# EAGLE schematic TurboMaster-optimized (EAGLE 7.7.0)
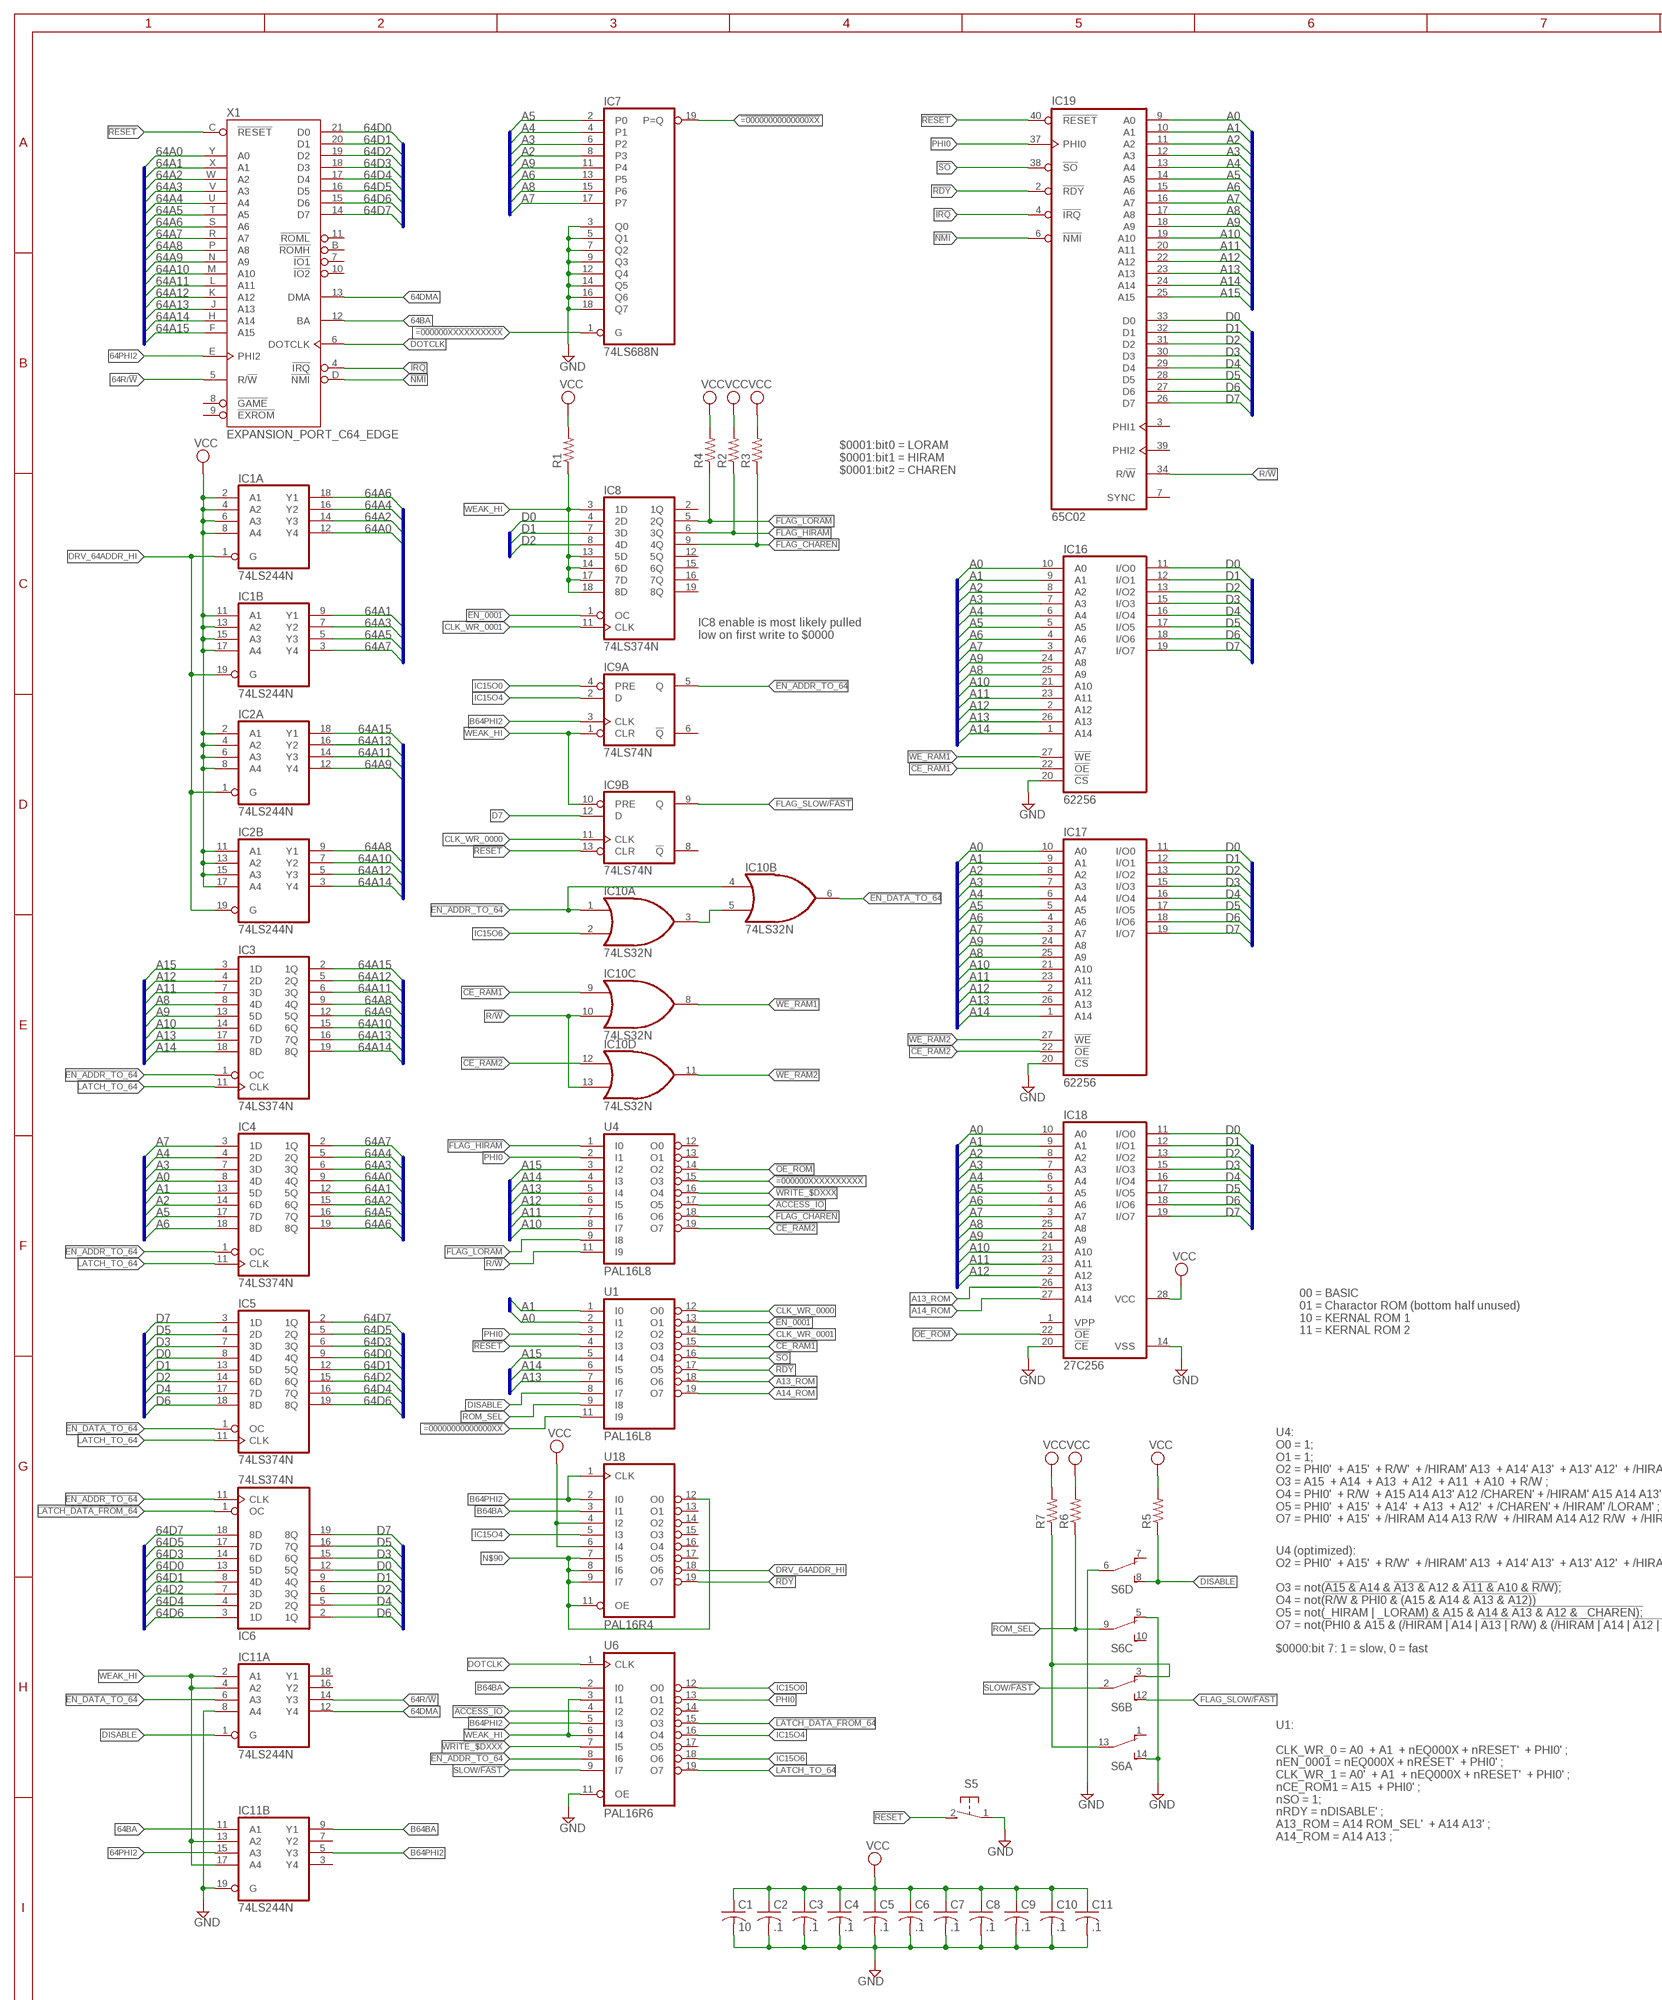
[diagram p0: schematic, sheet 1, part 1 of 2]
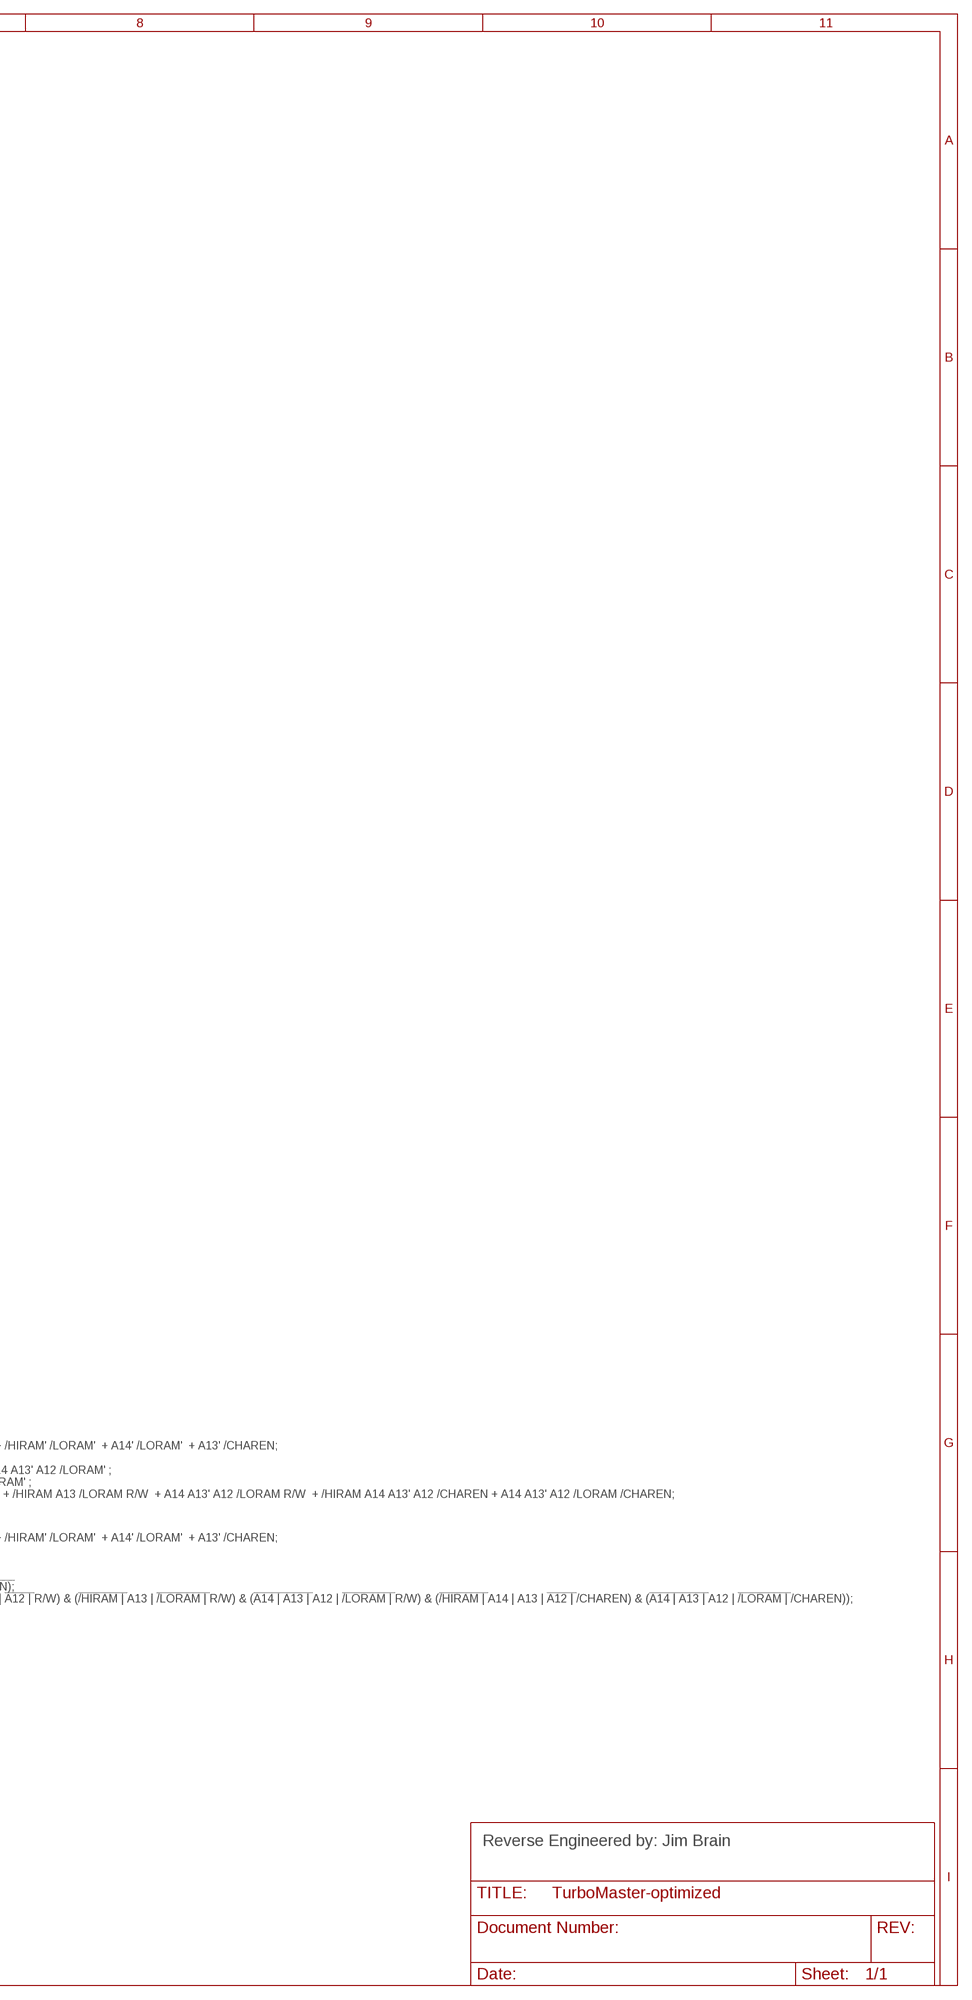
[diagram p1: schematic, sheet 1, part 2 of 2]

## Parts
C1  10  C-US050-024X044  [C050-024X044]
C2  .1  C-US050-024X044  [C050-024X044]
C3  .1  C-US050-024X044  [C050-024X044]
C4  .1  C-US050-024X044  [C050-024X044]
C5  .1  C-US050-024X044  [C050-024X044]
C6  .1  C-US050-024X044  [C050-024X044]
C7  .1  C-US050-024X044  [C050-024X044]
C8  .1  C-US050-024X044  [C050-024X044]
C9  .1  C-US050-024X044  [C050-024X044]
C10  .1  C-US050-024X044  [C050-024X044]
C11  .1  C-US050-024X044  [C050-024X044]
IC1  74LS244N  [DIL20]
IC2  74LS244N  [DIL20]
IC3  74LS374N  [DIL20]
IC4  74LS374N  [DIL20]
IC5  74LS374N  [DIL20]
IC6  74LS374N  [DIL20]
IC7  74LS688N  [DIL20]
IC8  74LS374N  [DIL20]
IC9  74LS74N  [DIL14]
IC10  74LS32N  [DIL14]
IC11  74LS244N  [DIL20]
IC16  62256  [DIL28]
IC17  62256  [DIL28]
IC18  27C256  27C256AG  [DIL28-6]
IC19  65C02  [DIL40]
R1  R-US_0207/10  [0207/10]
R2  R-US_0207/10  [0207/10]
R3  R-US_0207/10  [0207/10]
R4  R-US_0207/10  [0207/10]
R5  R-US_0207/10  [0207/10]
R6  R-US_0207/10  [0207/10]
R7  R-US_0207/10  [0207/10]
S5  31-XX  [B3F-31XX]
S6  DIP04DPDTS  [DIP04DPDTS]
U1  PAL16L8  16L8  [DIL20]
U4  PAL16L8  16L8  [DIL20]
U6  PAL16R6  16R6  [DIL20]
U18  PAL16R4  16R4  [DIL20]
X1  EXPANSION_PORT_C64_EDGE  [MA100-22-2]

## Nets
64A0: IC1.12(A:Y4) IC4.9(4Q) X1.Y(A0)
64A1: IC1.9(B:Y1) IC4.12(5Q) X1.X(A1)
64A2: IC1.14(A:Y3) IC4.15(6Q) X1.W(A2)
64A3: IC1.7(B:Y2) IC4.6(3Q) X1.V(A3)
64A4: IC1.16(A:Y2) IC4.5(2Q) X1.U(A4)
64A5: IC1.5(B:Y3) IC4.16(7Q) X1.T(A5)
64A6: IC1.18(A:Y1) IC4.19(8Q) X1.S(A6)
64A7: IC1.3(B:Y4) IC4.2(1Q) X1.R(A7)
64A8: IC2.9(B:Y1) IC3.9(4Q) X1.P(A8)
64A9: IC2.12(A:Y4) IC3.12(5Q) X1.N(A9)
64A10: IC2.7(B:Y2) IC3.15(6Q) X1.M(A10)
64A11: IC2.14(A:Y3) IC3.6(3Q) X1.L(A11)
64A12: IC2.5(B:Y3) IC3.5(2Q) X1.K(A12)
64A13: IC2.16(A:Y2) IC3.16(7Q) X1.J(A13)
64A14: IC2.3(B:Y4) IC3.19(8Q) X1.H(A14)
64A15: IC2.18(A:Y1) IC3.2(1Q) X1.F(A15)
64BA: IC11.11(B:A1) X1.12(BA)
64D0: IC5.9(4Q) IC6.13(5D) X1.21(D0)
64D1: IC5.12(5Q) IC6.8(4D) X1.20(D1)
64D2: IC5.15(6Q) IC6.7(3D) X1.19(D2)
64D3: IC5.6(3Q) IC6.14(6D) X1.18(D3)
64D4: IC5.16(7Q) IC6.4(2D) X1.17(D4)
64D5: IC5.5(2Q) IC6.17(7D) X1.16(D5)
64D6: IC5.19(8Q) IC6.3(1D) X1.15(D6)
64D7: IC5.2(1Q) IC6.18(8D) X1.14(D7)
64DMA: IC11.12(A:Y4) X1.13(DMA)
64PHI2: IC11.15(B:A3) X1.E(PHI2)
64R/!W: IC11.14(A:Y3) X1.5(R/!W)
!=00000000000000XX: IC7.19(P=Q) U1.11(I9)
!=000000XXXXXXXXXX: IC7.1(G) U4.15(O3)
!ACCESS_IO: U4.17(O5) U6.4(I2)
!CE_RAM1: IC10.9(C:I0) IC16.22(!OE) U1.15(O3)
!CE_RAM2: IC10.12(D:I0) IC17.22(!OE) U4.19(O7)
!EN_0001: IC8.1(OC) U1.13(O1)
!EN_ADDR_TO_64: IC3.1(OC) IC4.1(OC) IC6.11(CLK) IC9.5(A:Q) IC10.1(A:I0) IC10.4(B:I0) U6.8(I6)
!EN_DATA_TO_64: IC5.1(OC) IC10.6(B:O) IC11.6(A:A3)
!FLAG_CHAREN: IC8.9(4Q) R3.1 U4.18(O6)
!FLAG_HIRAM: IC8.6(3Q) R2.1 U4.1(I0)
!FLAG_LORAM: IC8.5(2Q) R4.1 U4.9(I8)
!IRQ: IC19.4(!IRQ) X1.4(!IRQ)
!LATCH_DATA_FROM_64: IC6.1(OC) U6.15(O3)
!NMI: IC19.6(!NMI) X1.D(!NMI)
!OE_ROM: IC18.22(!OE) U4.14(O2)
!RDY: IC19.2(!RDY) U1.17(O5) U18.19(O7)
!RESET: IC9.13(B:CLR) IC19.40(!RESET) S5.2(S) U1.4(I3) X1.C(!RESET)
!SO: IC19.38(!SO) U1.16(O4)
!WE_RAM1: IC10.8(C:O) IC16.27(!WE)
!WE_RAM2: IC10.11(D:O) IC17.27(!WE)
!WRITE_$DXXX: U4.16(O4) U6.7(I5)
A0: IC4.8(4D) IC16.10(A0) IC17.10(A0) IC18.10(A0) IC19.9(A0) U1.2(I1)
A1: IC4.13(5D) IC16.9(A1) IC17.9(A1) IC18.9(A1) IC19.10(A1) U1.1(I0)
A2: IC4.14(6D) IC7.8(P3) IC16.8(A2) IC17.8(A2) IC18.8(A2) IC19.11(A2)
A3: IC4.7(3D) IC7.6(P2) IC16.7(A3) IC17.7(A3) IC18.7(A3) IC19.12(A3)
A4: IC4.4(2D) IC7.4(P1) IC16.6(A4) IC17.6(A4) IC18.6(A4) IC19.13(A4)
A5: IC4.17(7D) IC7.2(P0) IC16.5(A5) IC17.5(A5) IC18.5(A5) IC19.14(A5)
A6: IC4.18(8D) IC7.13(P5) IC16.4(A6) IC17.4(A6) IC18.4(A6) IC19.15(A6)
A7: IC4.3(1D) IC7.17(P7) IC16.3(A7) IC17.3(A7) IC18.3(A7) IC19.16(A7)
A8: IC3.8(4D) IC7.15(P6) IC16.25(A9) IC17.25(A9) IC18.25(A8) IC19.17(A8)
A9: IC3.13(5D) IC7.11(P4) IC16.24(A8) IC17.24(A8) IC18.24(A9) IC19.18(A9)
A10: IC3.14(6D) IC16.21(A10) IC17.21(A10) IC18.21(A10) IC19.19(A10) U4.8(I7)
A11: IC3.7(3D) IC16.23(A11) IC17.23(A11) IC18.23(A11) IC19.20(A11) U4.7(I6)
A12: IC3.4(2D) IC16.2(A12) IC17.2(A12) IC18.2(A12) IC19.22(A12) U4.6(I5)
A13: IC3.17(7D) IC16.26(A13) IC17.26(A13) IC19.23(A13) U1.7(I6) U4.5(I4)
A13_ROM: IC18.26(A13) U1.18(O6)
A14: IC3.18(8D) IC16.1(A14) IC17.1(A14) IC19.24(A14) U1.6(I5) U4.4(I3)
A14_ROM: IC18.27(A14) U1.19(O7)
A15: IC3.3(1D) IC19.25(A15) U1.5(I4) U4.3(I2)
B64BA: IC11.9(B:Y1) U6.2(I0) U18.3(I1)
B64PHI2: IC9.3(A:CLK) IC11.5(B:Y3) U6.5(I3) U18.1(CLK) U18.2(I0)
CLK_WR_0000: IC9.11(B:CLK) U1.12(O0)
CLK_WR_0001: IC8.11(CLK) U1.14(O2)
D0: IC5.8(4D) IC6.12(5Q) IC8.4(2D) IC16.11(I/O0) IC17.11(I/O0) IC18.11(I/O0) IC19.33(D0)
D1: IC5.13(5D) IC6.9(4Q) IC8.7(3D) IC16.12(I/O1) IC17.12(I/O1) IC18.12(I/O1) IC19.32(D1)
D2: IC5.14(6D) IC6.6(3Q) IC8.8(4D) IC16.13(I/O2) IC17.13(I/O2) IC18.13(I/O2) IC19.31(D2)
D3: IC5.7(3D) IC6.15(6Q) IC16.15(I/O3) IC17.15(I/O3) IC18.15(I/O3) IC19.30(D3)
D4: IC5.17(7D) IC6.5(2Q) IC16.16(I/O4) IC17.16(I/O4) IC18.16(I/O4) IC19.29(D4)
D5: IC5.4(2D) IC6.16(7Q) IC16.17(I/O5) IC17.17(I/O5) IC18.17(I/O5) IC19.28(D5)
D6: IC5.18(8D) IC6.2(1Q) IC16.18(I/O6) IC17.18(I/O6) IC18.18(I/O6) IC19.27(D6)
D7: IC5.3(1D) IC6.19(8Q) IC9.12(B:D) IC16.19(I/O7) IC17.19(I/O7) IC18.19(I/O7) IC19.26(D7)
DISABLE: IC11.1(A:G) R5.1 S6.8(D:S) U1.8(I7)
DOTCLK: U6.1(CLK) X1.6(DOTCLK)
DRV_64ADDR_HI: IC1.1(A:G) IC1.19(B:G) IC2.1(A:G) IC2.19(B:G) U18.18(O6)
FLAG_SLOW/!FAST: IC9.9(B:Q) S6.12(B:S)
GND: C1.2 C2.2 C3.2 C4.2 C5.2 C6.2 C7.2 C8.2 C9.2 C10.2 C11.2 IC7.3(Q0) IC7.5(Q1) IC7.7(Q2) IC7.9(Q3) IC7.12(Q4) IC7.14(Q5) IC7.16(Q6) IC7.18(Q7) IC11.8(A:A4) IC11.19(B:G) IC16.20(!CS) IC17.20(!CS) IC18.14(VSS) IC18.20(!CE) S5.1(P) S6.5(C:O) S6.6(D:P) S6.14(A:S) U6.11(OE)
IC15O0: IC9.4(A:PRE) U6.12(O0)
IC15O4: IC9.2(A:D) U6.16(O4) U18.5(I3)
IC15O6: IC10.2(A:I1) U6.18(O6)
LATCH_TO_64: IC3.11(CLK) IC4.11(CLK) IC5.11(CLK) U6.19(O7)
N$52: R7.1 S6.3(B:O) S6.13(A:P)
N$65: IC10.3(A:O) IC10.5(B:I1)
N$90: U18.7(I5) U18.8(I6) U18.9(I7) U18.11(OE) U18.12(O0)
PHI0: IC19.37(PHI0) U1.3(I2) U4.2(I1) U6.13(O1)
R/!W: IC10.10(C:I1) IC10.13(D:I1) IC19.34(R/!W) U4.11(I9)
ROM_SEL: R6.1 S6.9(C:P) U1.9(I8)
SLOW/!FAST: S6.2(B:P) U6.9(I7)
VCC: C1.1 C2.1 C3.1 C4.1 C5.1 C6.1 C7.1 C8.1 C9.1 C10.1 C11.1 IC1.2(A:A1) IC1.4(A:A2) IC1.6(A:A3) IC1.8(A:A4) IC1.11(B:A1) IC1.13(B:A2) IC1.15(B:A3) IC1.17(B:A4) IC2.2(A:A1) IC2.4(A:A2) IC2.6(A:A3) IC2.8(A:A4) IC2.11(B:A1) IC2.13(B:A2) IC2.15(B:A3) IC2.17(B:A4) IC18.28(VCC) R1.2 R2.2 R3.2 R4.2 R5.2 R6.2 R7.2 U18.4(I2) U18.6(I4)
WEAK_HI: IC8.3(1D) IC8.13(5D) IC8.14(6D) IC8.17(7D) IC8.18(8D) IC9.1(A:CLR) IC9.10(B:PRE) IC11.2(A:A1) IC11.4(A:A2) IC11.13(B:A2) IC11.17(B:A4) R1.1 U6.3(I1) U6.6(I4)
Unconnected: IC8.2(1Q) IC8.12(5Q) IC8.15(6Q) IC8.16(7Q) IC8.19(8Q) IC9.6(A:!Q) IC9.8(B:!Q) IC11.3(B:Y4) IC11.7(B:Y2) IC11.16(A:Y2) IC11.18(A:Y1) IC18.1(VPP) IC19.3(PHI1) IC19.7(SYNC) IC19.39(PHI2) S6.1(A:O) S6.7(D:O) S6.10(C:S) U4.12(O0) U4.13(O1) U6.14(O2) U6.17(O5) U18.13(O1) U18.14(O2) U18.15(O3) U18.16(O4) U18.17(O5) X1.7(!IO1) X1.8(!GAME) X1.9(!EXROM) X1.10(!IO2) X1.11(!ROML) X1.B(!ROMH)

## Buses
64A[0..15]
A[0..15]
D[0..7]
64D[0..7]

## Notes on the sheet
- $0001:bit0 = LORAM
  $0001:bit1 = HIRAM
  $0001:bit2 = CHAREN
- IC8 enable is most likely pulled
  low on first write to $0000
- 00 = BASIC
  01 = Charactor ROM (bottom half unused)
  10 = KERNAL ROM 1
  11 = KERNAL ROM 2
- U4:
  O0 = 1;
  O1 = 1;
  O2 = PHI0'  + A15'  + R/W'  + /HIRAM' A13  + A14' A13'  + A13' A12'  + /HIRAM' /LORAM'  + A14' /LORAM'  + A13' /CHAREN;
  O3 = A15  + A14  + A13  + A12  + A11  + A10  + R/W ;
  O4 = PHI0'  + R/W  + A15 A14 A13' A12 /CHAREN' + /HIRAM' A15 A14 A13' A12 /LORAM' ;
  O5 = PHI0'  + A15'  + A14'  + A13  + A12'  + /CHAREN' + /HIRAM' /LORAM' ;
  O7 = PHI0'  + A15'  + /HIRAM A14 A13 R/W  + /HIRAM A14 A12 R/W  + /HIRAM A13 /LORAM R/W  + A14 A13' A12 /LORAM R/W  + /HIRAM A14 A13' A12 /CHAREN + A14 A13' A12 /LORAM /CHAREN;
- U4 (optimized):
  O2 = PHI0'  + A15'  + R/W'  + /HIRAM' A13  + A14' A13'  + A13' A12'  + /HIRAM' /LORAM'  + A14' /LORAM'  + A13' /CHAREN;
  
  O3 = not(!A15 & !A14 & !A13 & !A12 & !A11 & !A10 & !R/W);
  O4 = not(!R/W & PHI0 & !(A15 & A14 & !A13 & A12))
  O5 = not(_HIRAM | _LORAM) & A15 & A14 & !A13 & A12 & _CHAREN);
  O7 = not(PHI0 & A15 & (!/HIRAM | !A14 | !A13 | !R/W) & (!/HIRAM | !A14 | !A12 | !R/W) & (!/HIRAM | !A13 | !/LORAM | !R/W) & (!A14 | A13 | !A12 | !/LORAM | !R/W) & (!/HIRAM | !A14 | A13 | !A12 | !/CHAREN) & (!A14 | A13 | !A12 | !/LORAM | !/CHAREN));
- $0000:bit 7: 1 = slow, 0 = fast
- U1:
  
  CLK_WR_0 = A0  + A1  + nEQ000X + nRESET'  + PHI0' ;
  nEN_0001 = nEQ000X + nRESET'  + PHI0' ;
  CLK_WR_1 = A0'  + A1  + nEQ000X + nRESET'  + PHI0' ;
  nCE_ROM1 = A15  + PHI0' ;
  nSO = 1;
  nRDY = nDISABLE' ;
  A13_ROM = A14 ROM_SEL'  + A14 A13' ;
  A14_ROM = A14 A13 ;
- Reverse Engineered by: Jim Brain

## Power pins joined to a net without a drawn wire
GND: IC1.10(P:GND) IC2.10(P:GND) IC3.10(GND) IC4.10(GND) IC5.10(GND) IC6.10(GND) IC7.10(GND) IC8.10(GND) IC9.7(P:GND) IC10.7(P:GND) IC11.10(P:GND) IC16.14(GND) IC17.14(GND) IC19.1(GND) IC19.21(GND) U1.10(GND) U4.10(GND) U6.10(GND) U18.10(GND) X1.1(GND) X1.22(GND) X1.A(GND) X1.Z(GND)
VCC: IC1.20(P:VCC) IC2.20(P:VCC) IC3.20(VCC) IC4.20(VCC) IC5.20(VCC) IC6.20(VCC) IC7.20(VCC) IC8.20(VCC) IC9.14(P:VCC) IC10.14(P:VCC) IC11.20(P:VCC) IC16.28(VCC) IC17.28(VCC) IC19.8(VCC) U1.20(VCC) U4.20(VCC) U6.20(VCC) U18.20(VCC) X1.2(VCC) X1.3(VCC)

## Library data of the parts
C1-C11 = resistor:C-US: CAPACITOR, American symbol
IC1 IC2 IC11 = 74xx-us:74*244: Octal BUFFER and LINE DRIVER, 3-state
IC3-IC6 IC8 = 74xx-us:74*374: Octal D type transparent LATCH, edge triggered
IC7 = 74xx-us:74*688: 8-bit MAGNITUDE/IDENTITY COMPARATOR, totem pole
IC9 = 74xx-us:74*74: Dual D type positive edge triggered FLIP FLOP, preset and clear
IC10 = 74xx-us:74*32: Quad 2-input OR gate
IC16 IC17 = GIMEchip:62256: 32K*8 SRAM
IC18 = memory-hitachi:27C256AG: MEMORY; OC_FARNELL: unknown; OC_NEWARK: unknown
IC19 = commodore:65*02: 6502 processor
R1-R7 = resistor:R-US_: RESISTOR, American symbol
S5 = switch-omron:31-XX: OMRON SWITCH; MPN: B3F-3100; OC_FARNELL: 959704; OC_NEWARK: 36M3582
S6 = switch-dil-jlb:DIP04DPDTS: DIL/CODE SWITCH; OC_FARNELL: unknown; OC_NEWARK: unknown
U1 U4 = pal:16L8: PAL; MF: TEXAS INSTRUMENTS; MPN: TIBPAL16L8-7CN; OC_FARNELL: 1510033; OC_NEWARK: 08F8522
U6 = pal:16R6: PAL; MPN: TIBPAL16R6-10CN; OC_FARNELL: 1753789; OC_NEWARK: 90R9355
U18 = pal:16R4: PAL; MF: TEXAS INSTRUMENTS; MPN: TIBPAL16R4-10CN; OC_FARNELL: 1753788; OC_NEWARK: 08F8524
X1 = commodore:EXPANSION_PORT_C64_EDGE